# EAGLE design untitled (EAGLE 9.6.2)
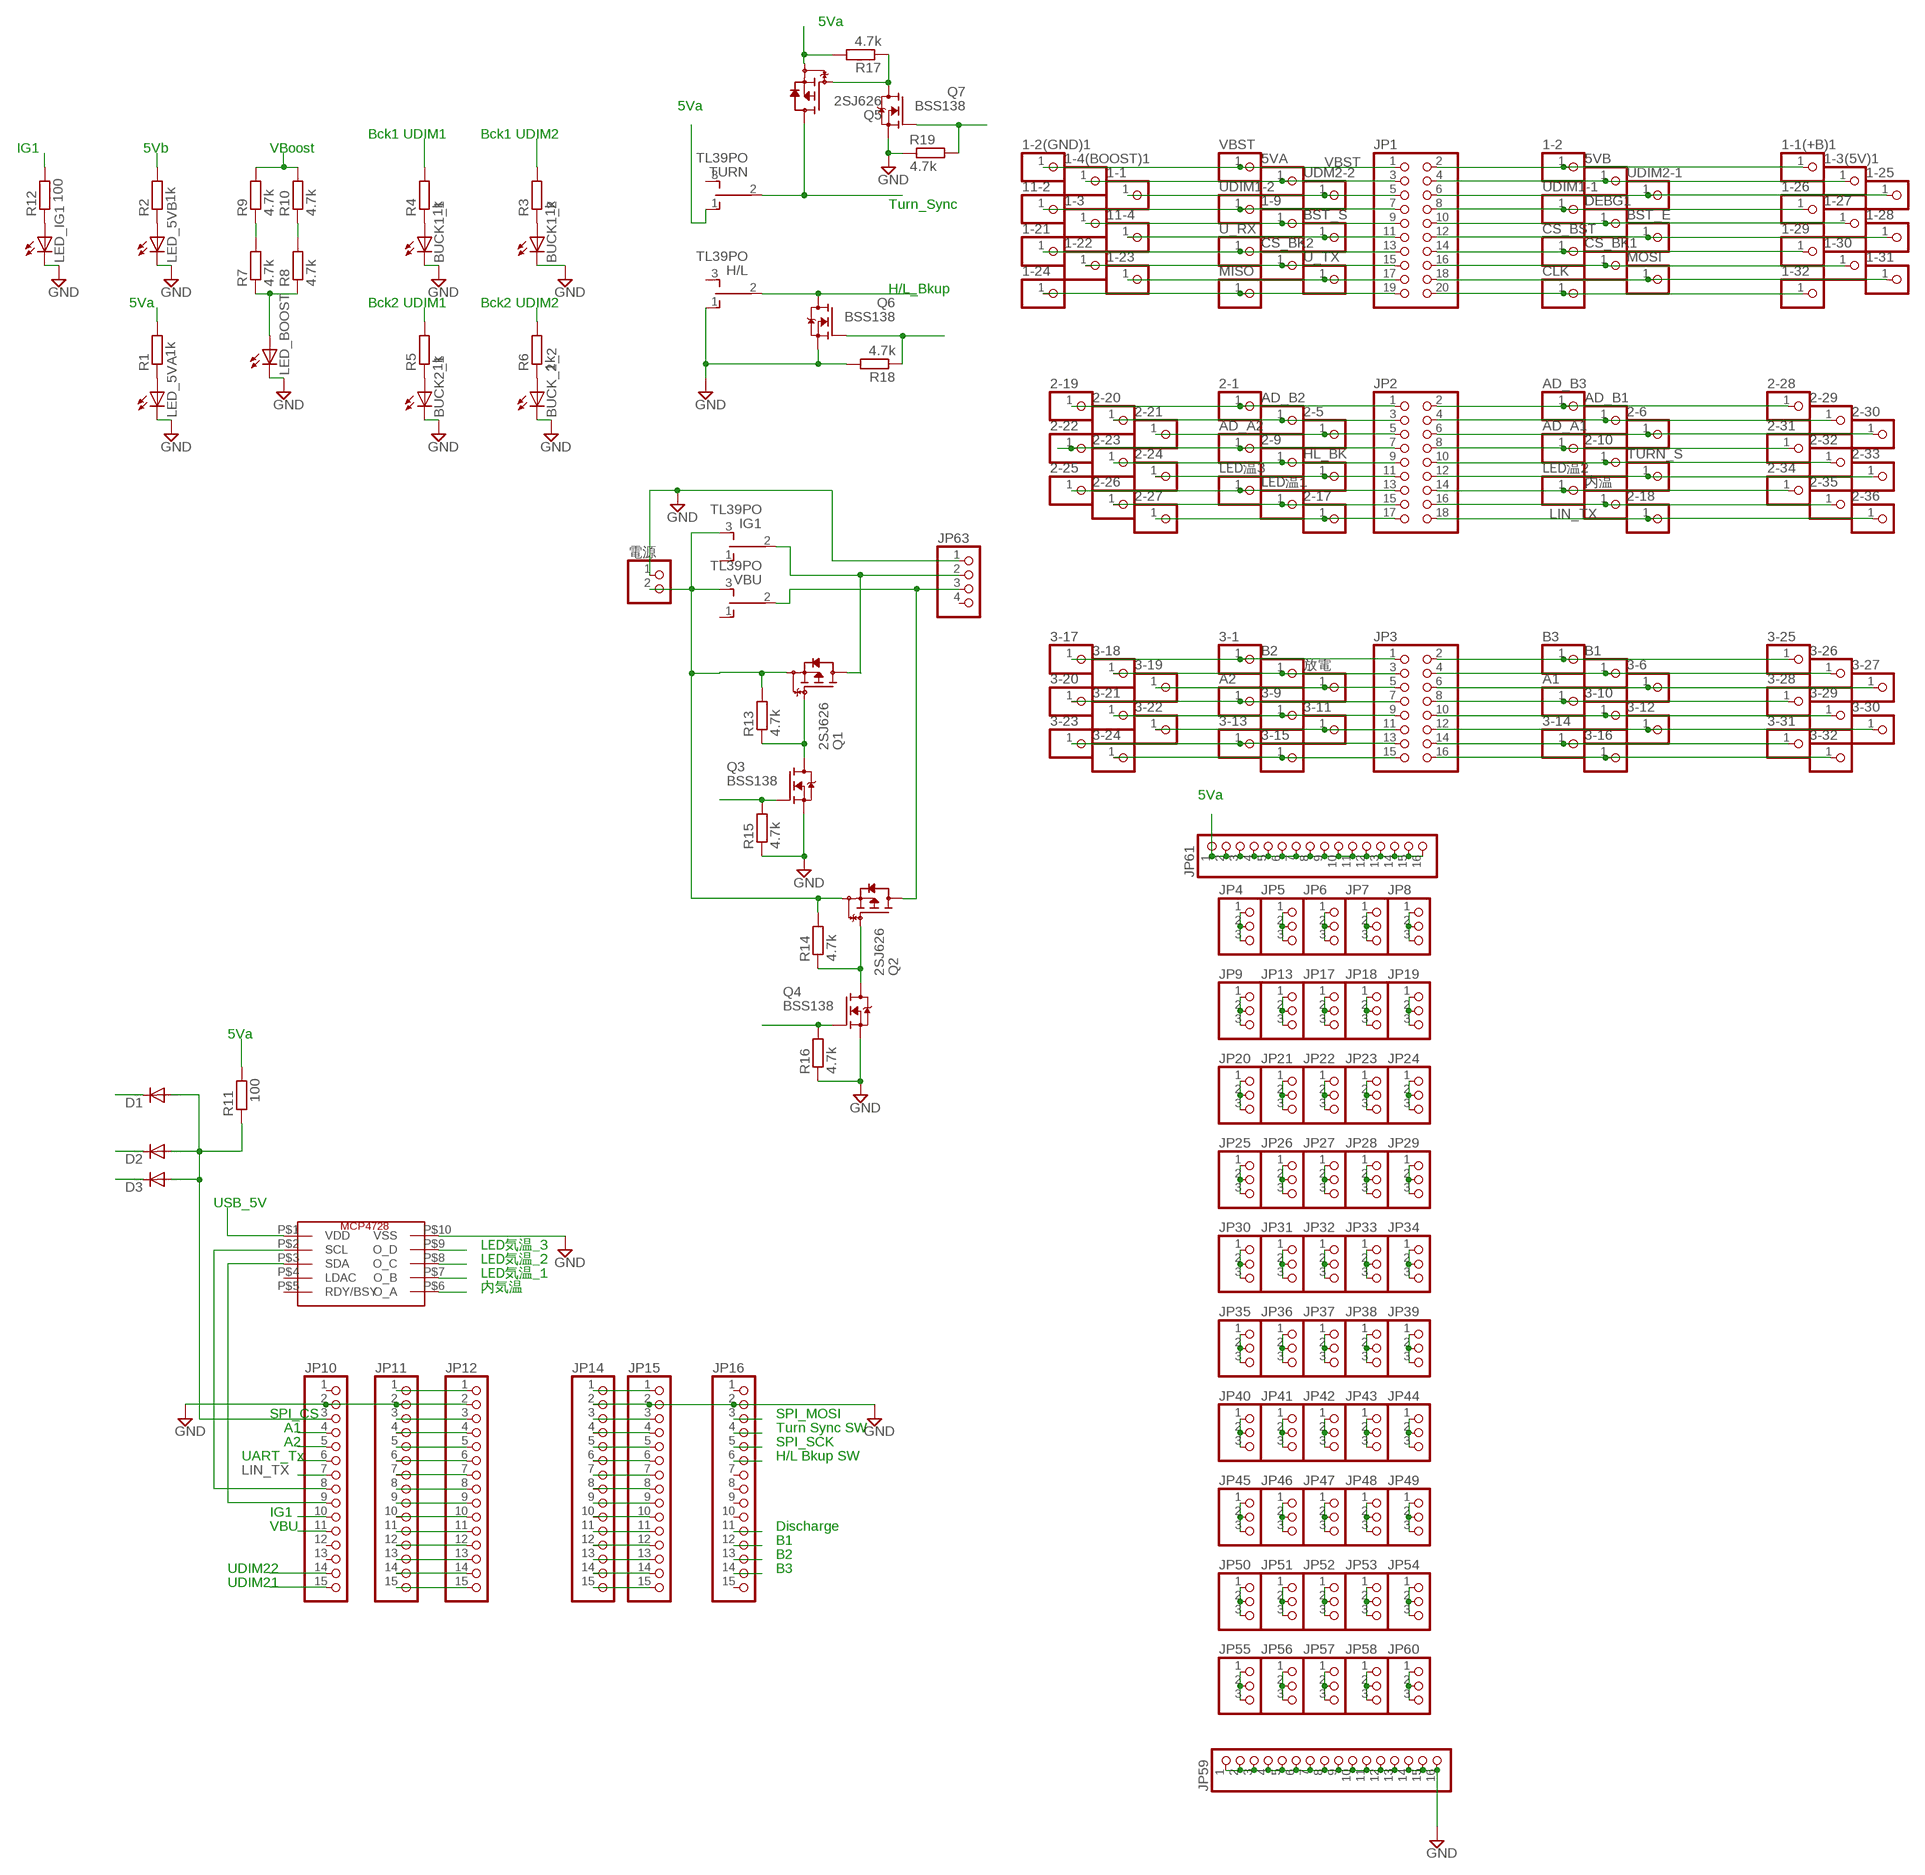
[diagram p0: schematic, sheet 1]

## Parts
1-1  PINHD-1X1  [1X01]
1-1(+B)1  PINHD-1X1  [1X01]
1-2  PINHD-1X1  [1X01]
1-2(GND)1  PINHD-1X1  [1X01]
1-3  PINHD-1X1  [1X01]
1-3(5V)1  PINHD-1X1  [1X01]
1-4(BOOST)1  PINHD-1X1  [1X01]
1-9  PINHD-1X1  [1X01]
1-21  PINHD-1X1  [1X01]
1-22  PINHD-1X1  [1X01]
1-23  PINHD-1X1  [1X01]
1-24  PINHD-1X1  [1X01]
1-25  PINHD-1X1  [1X01]
1-26  PINHD-1X1  [1X01]
1-27  PINHD-1X1  [1X01]
1-28  PINHD-1X1  [1X01]
1-29  PINHD-1X1  [1X01]
1-30  PINHD-1X1  [1X01]
1-31  PINHD-1X1  [1X01]
1-32  PINHD-1X1  [1X01]
2-1  PINHD-1X1  [1X01]
2-5  PINHD-1X1  [1X01]
2-6  PINHD-1X1  [1X01]
2-9  PINHD-1X1  [1X01]
2-10  PINHD-1X1  [1X01]
2-17  PINHD-1X1  [1X01]
2-18  PINHD-1X1  [1X01]
2-19  PINHD-1X1  [1X01]
2-20  PINHD-1X1  [1X01]
2-21  PINHD-1X1  [1X01]
2-22  PINHD-1X1  [1X01]
2-23  PINHD-1X1  [1X01]
2-24  PINHD-1X1  [1X01]
2-25  PINHD-1X1  [1X01]
2-26  PINHD-1X1  [1X01]
2-27  PINHD-1X1  [1X01]
2-28  PINHD-1X1  [1X01]
2-29  PINHD-1X1  [1X01]
2-30  PINHD-1X1  [1X01]
2-31  PINHD-1X1  [1X01]
2-32  PINHD-1X1  [1X01]
2-33  PINHD-1X1  [1X01]
2-34  PINHD-1X1  [1X01]
2-35  PINHD-1X1  [1X01]
2-36  PINHD-1X1  [1X01]
3-1  PINHD-1X1  [1X01]
3-6  PINHD-1X1  [1X01]
3-9  PINHD-1X1  [1X01]
3-10  PINHD-1X1  [1X01]
3-11  PINHD-1X1  [1X01]
3-12  PINHD-1X1  [1X01]
3-13  PINHD-1X1  [1X01]
3-14  PINHD-1X1  [1X01]
3-15  PINHD-1X1  [1X01]
3-16  PINHD-1X1  [1X01]
3-17  PINHD-1X1  [1X01]
3-18  PINHD-1X1  [1X01]
3-19  PINHD-1X1  [1X01]
3-20  PINHD-1X1  [1X01]
3-21  PINHD-1X1  [1X01]
3-22  PINHD-1X1  [1X01]
3-23  PINHD-1X1  [1X01]
3-24  PINHD-1X1  [1X01]
3-25  PINHD-1X1  [1X01]
3-26  PINHD-1X1  [1X01]
3-27  PINHD-1X1  [1X01]
3-28  PINHD-1X1  [1X01]
3-29  PINHD-1X1  [1X01]
3-30  PINHD-1X1  [1X01]
3-31  PINHD-1X1  [1X01]
3-32  PINHD-1X1  [1X01]
5VA  PINHD-1X1  [1X01]
5VB  PINHD-1X1  [1X01]
11-2  PINHD-1X1  [1X01]
11-4  PINHD-1X1  [1X01]
A1  PINHD-1X1  [1X01]
A2  PINHD-1X1  [1X01]
AD_A1  PINHD-1X1  [1X01]
AD_A2  PINHD-1X1  [1X01]
AD_B1  PINHD-1X1  [1X01]
AD_B2  PINHD-1X1  [1X01]
AD_B3  PINHD-1X1  [1X01]
B1  PINHD-1X1  [1X01]
B2  PINHD-1X1  [1X01]
B3  PINHD-1X1  [1X01]
BST_E  PINHD-1X1  [1X01]
BST_S  PINHD-1X1  [1X01]
BUCK1_1  LEDCHIP-LED0603  [CHIP-LED0603]
BUCK1_2  LEDCHIP-LED0603  [CHIP-LED0603]
BUCK2_1  LEDCHIP-LED0603  [CHIP-LED0603]
BUCK_2_2  LEDCHIP-LED0603  [CHIP-LED0603]
CLK  PINHD-1X1  [1X01]
CS_BK1  PINHD-1X1  [1X01]
CS_BK2  PINHD-1X1  [1X01]
CS_BST  PINHD-1X1  [1X01]
D1  DIODE-SOD523  [SOD523]
D2  DIODE-SOD523  [SOD523]
D3  DIODE-SOD523  [SOD523]
DEBG1  PINHD-1X1  [1X01]
H/L  TL39PO  [TL3XPO]
HL_BK  PINHD-1X1  [1X01]
IG1  TL39PO  [TL3XPO]
JP1  PINHD-2X10  [2X10]
JP2  PINHD-2X9  [2X09]
JP3  PINHD-2X8  [2X08]
JP4  PINHD-1X3  [1X03]
JP5  PINHD-1X3  [1X03]
JP6  PINHD-1X3  [1X03]
JP7  PINHD-1X3  [1X03]
JP8  PINHD-1X3  [1X03]
JP9  PINHD-1X3  [1X03]
JP10  PINHD-1X15  [1X15]
JP11  PINHD-1X15  [1X15]
JP12  PINHD-1X15  [1X15]
JP13  PINHD-1X3  [1X03]
JP14  PINHD-1X15  [1X15]
JP15  PINHD-1X15  [1X15]
JP16  PINHD-1X15  [1X15]
JP17  PINHD-1X3  [1X03]
JP18  PINHD-1X3  [1X03]
JP19  PINHD-1X3  [1X03]
JP20  PINHD-1X3  [1X03]
JP21  PINHD-1X3  [1X03]
JP22  PINHD-1X3  [1X03]
JP23  PINHD-1X3  [1X03]
JP24  PINHD-1X3  [1X03]
JP25  PINHD-1X3  [1X03]
JP26  PINHD-1X3  [1X03]
JP27  PINHD-1X3  [1X03]
JP28  PINHD-1X3  [1X03]
JP29  PINHD-1X3  [1X03]
JP30  PINHD-1X3  [1X03]
JP31  PINHD-1X3  [1X03]
JP32  PINHD-1X3  [1X03]
JP33  PINHD-1X3  [1X03]
JP34  PINHD-1X3  [1X03]
JP35  PINHD-1X3  [1X03]
JP36  PINHD-1X3  [1X03]
JP37  PINHD-1X3  [1X03]
JP38  PINHD-1X3  [1X03]
JP39  PINHD-1X3  [1X03]
JP40  PINHD-1X3  [1X03]
JP41  PINHD-1X3  [1X03]
JP42  PINHD-1X3  [1X03]
JP43  PINHD-1X3  [1X03]
JP44  PINHD-1X3  [1X03]
JP45  PINHD-1X3  [1X03]
JP46  PINHD-1X3  [1X03]
JP47  PINHD-1X3  [1X03]
JP48  PINHD-1X3  [1X03]
JP49  PINHD-1X3  [1X03]
JP50  PINHD-1X3  [1X03]
JP51  PINHD-1X3  [1X03]
JP52  PINHD-1X3  [1X03]
JP53  PINHD-1X3  [1X03]
JP54  PINHD-1X3  [1X03]
JP55  PINHD-1X3  [1X03]
JP56  PINHD-1X3  [1X03]
JP57  PINHD-1X3  [1X03]
JP58  PINHD-1X3  [1X03]
JP59  PINHD-1X16  [1X16]
JP60  PINHD-1X3  [1X03]
JP61  PINHD-1X16  [1X16]
JP63  PINHD-1X4  [1X04]
LED_5VA  LEDCHIP-LED0603  [CHIP-LED0603]
LED_5VB  LEDCHIP-LED0603  [CHIP-LED0603]
LED_BOOST  LEDCHIP-LED0603  [CHIP-LED0603]
LED_IG1  LEDCHIP-LED0603  [CHIP-LED0603]
LED温1  PINHD-1X1  [1X01]
LED温2  PINHD-1X1  [1X01]
LED温3  PINHD-1X1  [1X01]
MISO  PINHD-1X1  [1X01]
MOSI  PINHD-1X1  [1X01]
Q1  2SJ626  [SOT23]
Q2  2SJ626  [SOT23]
Q3  BSS138  [SOT23]
Q4  BSS138  [SOT23]
Q5  2SJ626  [SOT23]
Q6  BSS138  [SOT23]
Q7  BSS138  [SOT23]
R1  1k  R-EU_R0603  [R0603]
R2  1k  R-EU_R0603  [R0603]
R3  1k  R-EU_R0603  [R0603]
R4  1k  R-EU_R0603  [R0603]
R5  1k  R-EU_R0603  [R0603]
R6  1k  R-EU_R0603  [R0603]
R7  4.7k  R-EU_R0603  [R0603]
R8  4.7k  R-EU_R0603  [R0603]
R9  4.7k  R-EU_R0603  [R0603]
R10  4.7k  R-EU_R0603  [R0603]
R11  100  R-EU_R0603  [R0603]
R12  100  R-EU_R0603  [R0603]
R13  4.7k  R-EU_R0603  [R0603]
R14  4.7k  R-EU_R0603  [R0603]
R15  4.7k  R-EU_R0603  [R0603]
R16  4.7k  R-EU_R0603  [R0603]
R17  4.7k  R-EU_R0603  [R0603]
R18  4.7k  R-EU_R0603  [R0603]
R19  4.7k  R-EU_R0603  [R0603]
TURN  TL39PO  [TL3XPO]
TURN_S  PINHD-1X1  [1X01]
U$1  MCP4728  [MCP4728]
U_RX  PINHD-1X1  [1X01]
U_TX  PINHD-1X1  [1X01]
UDIM1-1  PINHD-1X1  [1X01]
UDIM1-2  PINHD-1X1  [1X01]
UDIM2-1  PINHD-1X1  [1X01]
UDM2-2  PINHD-1X1  [1X01]
VBST  PINHD-1X1  [1X01]
VBU  TL39PO  [TL3XPO]
内温  PINHD-1X1  [1X01]
放電  PINHD-1X1  [1X01]
電源  PINHD-1X2  [1X02]

## Nets
5VA: 1-4(BOOST)1.1 5VA.1 JP1.3 JP61.1 JP61.2 JP61.3 JP61.4 JP61.5 JP61.6 JP61.7 JP61.8 JP61.9 JP61.10 JP61.11 JP61.12 JP61.13 JP61.14 JP61.15 JP61.16 Q5.2(S) R1.2 R11.2 R17.2 TURN.1(O)
5VB: 1-3(5V)1.1 5VB.1 JP1.4 R2.2
+B: 1-1(+B)1.1 1-2.1 JP1.2
+B(電源): IG1.3(S) Q1.2(S) Q2.2(S) R13.2 R14.2 VBU.3(S) 電源.2
A1: 3-28.1 A1.1 JP3.8 JP10.4
A2: 3-20.1 A2.1 JP3.7 JP10.5
AD_A1: 2-31.1 AD_A1.1 JP2.8
AD_A2: 2-22.1 AD_A2.1 JP2.7
AD_B1: 2-29.1 AD_B1.1 JP2.4
AD_B2: 2-20.1 AD_B2.1 JP2.3
AD_B3: 2-28.1 AD_B3.1 JP2.2
B1: 3-26.1 B1.1 JP3.4 JP16.12
B2: 3-18.1 B2.1 JP3.3 JP16.13
B3: 3-25.1 B3.1 JP3.2 JP16.14
BCK1UDIM1: 1-26.1 JP1.8 R4.2 UDIM1-1.1
BCK1UDIM2: 11-2.1 JP1.7 R3.2 UDIM1-2.1
BCK2UDIM1: 1-25.1 JP1.6 JP10.15 R5.2 UDIM2-1.1
BCK2UDIM2: 1-1.1 JP1.5 JP10.14 R6.2 UDM2-2.1
BSTENABLE: 1-28.1 BST_E.1 JP1.12
BSTSYNC: 11-4.1 BST_S.1 JP1.11
DEBUG1: 1-27.1 DEBG1.1 JP1.10
DISCHARGE: 3-19.1 JP3.5 JP16.11 放電.1
ESP32_HL_BKUP: JP16.6 Q6.1(G) R18.1
ESP32_SPI_CS: D1.A D2.A D3.A JP10.3 R11.1
ESP32_TURN_SYNC: JP16.4 Q7.1(G) R19.2
ESP_IG1_SW: JP10.10 Q3.1(G) R15.2
ESP_VBU_SW: JP10.11 Q4.1(G) R16.2
GND: BUCK1_1.C BUCK1_2.C BUCK2_1.C BUCK_2_2.C H/L.1(O) JP10.2 JP11.2 JP12.2 JP14.2 JP15.2 JP16.2 JP59.1 JP59.2 JP59.3 JP59.4 JP59.5 JP59.6 JP59.7 JP59.8 JP59.9 JP59.10 JP59.11 JP59.12 JP59.13 JP59.14 JP59.15 JP59.16 JP63.1 LED_5VA.C LED_5VB.C LED_BOOST.C LED_IG1.C Q3.2(S) Q4.2(S) Q6.2(S) Q7.2(S) R15.1 R16.1 R18.2 R19.1 U$1.P$10(VSS) 電源.1
HL_BKUP: 2-24.1 H/L.2(P) HL_BK.1 JP2.11 Q6.3(D)
IG1: IG1.2(P) JP63.2 Q1.3(D) R12.2
INSIDE_THM: 2-35.1 JP2.16 U$1.P$6(O_A) 内温.1
LED_THM1: 2-26.1 JP2.15 LED温1.1 U$1.P$7(O_B)
LED_THM2: 2-34.1 JP2.14 LED温2.1 U$1.P$8(O_C)
LED_THM3: 2-25.1 JP2.13 LED温3.1 U$1.P$9(O_D)
LIN_TX: 2-18.1 2-36.1 JP2.18 JP10.7
N$1: LED_5VB.A R2.1
N$2: LED_5VA.A R1.1
N$3: BUCK1_1.A R4.1
N$4: R7.2 R9.1
N$6: R8.2 R10.1
N$7: JP4.1 JP4.2 JP4.3
N$8: JP5.1 JP5.2 JP5.3
N$9: JP6.1 JP6.2 JP6.3
N$10: JP7.1 JP7.2 JP7.3
N$11: JP8.1 JP8.2 JP8.3
N$12: JP9.1 JP9.2 JP9.3
N$13: JP13.1 JP13.2 JP13.3
N$14: JP17.1 JP17.2 JP17.3
N$15: JP18.1 JP18.2 JP18.3
N$16: JP19.1 JP19.2 JP19.3
N$17: 1-3.1 1-9.1 JP1.9
N$18: JP20.1 JP20.2 JP20.3
N$19: JP21.1 JP21.2 JP21.3
N$20: BUCK1_2.A R3.1
N$21: 2-1.1 2-19.1 JP2.1
N$22: JP22.1 JP22.2 JP22.3
N$23: 2-5.1 2-21.1 JP2.5
N$24: JP23.1 JP23.2 JP23.3
N$25: 2-9.1 2-23.1 JP2.9
N$26: JP24.1 JP24.2 JP24.3
N$27: JP25.1 JP25.2 JP25.3
N$28: JP26.1 JP26.2 JP26.3
N$29: 2-17.1 2-27.1 JP2.17
N$31: JP27.1 JP27.2 JP27.3
N$32: JP28.1 JP28.2 JP28.3
N$33: JP29.1 JP29.2 JP29.3
N$34: 2-10.1 2-32.1 JP2.10
N$35: JP30.1 JP30.2 JP30.3
N$36: 2-6.1 2-30.1 JP2.6
N$37: JP31.1 JP31.2 JP31.3
N$38: JP32.1 JP32.2 JP32.3
N$39: 3-1.1 3-17.1 JP3.1
N$40: JP33.1 JP33.2 JP33.3
N$41: JP34.1 JP34.2 JP34.3
N$42: JP35.1 JP35.2 JP35.3
N$43: 3-9.1 3-21.1 JP3.9
N$44: 3-11.1 3-22.1 JP3.11
N$45: 3-13.1 3-23.1 JP3.13
N$46: 3-15.1 3-24.1 JP3.15
N$47: JP36.1 JP36.2 JP36.3
N$48: JP14.3 JP15.3
N$49: 3-6.1 3-27.1 JP3.6
N$50: JP37.1 JP37.2 JP37.3
N$51: 3-10.1 3-29.1 JP3.10
N$52: 3-12.1 3-30.1 JP3.12
N$53: 3-14.1 3-31.1 JP3.14
N$54: 3-16.1 3-32.1 JP3.16
N$55: BUCK2_1.A R5.1
N$56: BUCK_2_2.A R6.1
N$57: JP38.1 JP38.2 JP38.3
N$58: LED_BOOST.A R7.1 R8.1
N$59: Q5.1(G) Q7.3(D) R17.1
N$60: LED_IG1.A R12.1
N$61: JP14.4 JP15.4
N$62: Q1.1(G) Q3.3(D) R13.1
N$63: Q2.1(G) Q4.3(D) R14.1
N$64: JP14.5 JP15.5
N$65: JP14.6 JP15.6
N$66: JP14.7 JP15.7
N$67: JP14.8 JP15.8
N$68: JP14.9 JP15.9
N$70: JP14.10 JP15.10
N$71: JP14.11 JP15.11
N$72: JP14.12 JP15.12
N$73: JP14.13 JP15.13
N$74: JP14.14 JP15.14
N$75: JP14.15 JP15.15
N$76: JP11.1 JP12.1
N$77: JP39.1 JP39.2 JP39.3
N$78: JP11.3 JP12.3
N$79: JP11.4 JP12.4
N$80: JP11.5 JP12.5
N$81: JP11.6 JP12.6
N$82: JP11.8 JP12.8
N$83: JP11.7 JP12.7
N$84: JP11.9 JP12.9
N$85: JP11.10 JP12.10
N$86: JP11.11 JP12.11
N$87: JP11.12 JP12.12
N$88: JP11.13 JP12.13
N$89: JP11.14 JP12.14
N$90: JP11.15 JP12.15
N$91: JP10.8 U$1.P$2(SCL)
N$92: JP10.9 U$1.P$3(SDA)
N$93: JP40.1 JP40.2 JP40.3
N$94: JP41.1 JP41.2 JP41.3
N$95: JP42.1 JP42.2 JP42.3
N$96: JP43.1 JP43.2 JP43.3
N$97: JP44.1 JP44.2 JP44.3
N$98: JP45.1 JP45.2 JP45.3
N$99: JP46.1 JP46.2 JP46.3
N$100: JP47.1 JP47.2 JP47.3
N$101: JP48.1 JP48.2 JP48.3
N$102: JP49.1 JP49.2 JP49.3
N$103: JP50.1 JP50.2 JP50.3
N$104: JP51.1 JP51.2 JP51.3
N$105: JP52.1 JP52.2 JP52.3
N$106: JP53.1 JP53.2 JP53.3
N$107: JP54.1 JP54.2 JP54.3
N$108: JP55.1 JP55.2 JP55.3
N$109: JP56.1 JP56.2 JP56.3
N$110: JP57.1 JP57.2 JP57.3
N$111: JP58.1 JP58.2 JP58.3
N$112: JP60.1 JP60.2 JP60.3
SPI_CLK: 1-32.1 CLK.1 JP1.20 JP16.5
SPI_CS_BK1: 1-30.1 CS_BK1.1 D1.C JP1.16
SPI_CS_BK2: 1-22.1 CS_BK2.1 D2.C JP1.15
SPI_CS_BST: 1-29.1 CS_BST.1 D3.C JP1.14
SPI_MISO: 1-24.1 JP1.19 MISO.1
SPI_MOSI: 1-31.1 JP1.18 JP16.3 MOSI.1
TURN_SYNC: 2-33.1 JP2.12 Q5.3(D) TURN.2(P) TURN_S.1
UARTRX: 1-21.1 JP1.13 U_RX.1
UARTTX: 1-23.1 JP1.17 JP10.6 U_TX.1
USB_5V: JP14.1 JP15.1 U$1.P$1(VDD)
VBST: 1-2(GND)1.1 JP1.1 R9.2 R10.2 VBST.1
VBU: JP63.3 Q2.3(D) VBU.2(P)
Unconnected: H/L.3(S) IG1.1(O) JP10.1 JP10.12 JP10.13 JP16.1 JP16.7 JP16.8 JP16.9 JP16.10 JP16.15 JP63.4 TURN.3(S) U$1.P$4(LDAC) U$1.P$5(RDY/BSY) VBU.1(O)

## Notes on the sheet
- 5Va
- 5Va
- Bck1 UDIM1 | Bck1 UDIM2
- IG1 | 5Vb | VBoost
- Turn_Sync
- H/L_Bkup
- 5Va | Bck2 UDIM1 | Bck2 UDIM2
- 5Va
- 5Va
- USB_5V
- LED気温_3
- LED気温_2
- LED気温_1
- 内気温
- SPI_CS | SPI_MOSI
- A1 | Turn Sync SW
- A2 | SPI_SCK
- UART_Tx | H/L Bkup SW
- IG1
- VBU | Discharge
- B1
- B2
- UDIM22 | B3
- UDIM21

## Library data of the parts
1-1 1-1(+B)1 1-2 1-2(GND)1 1-3 1-3(5V)1 1-4(BOOST)1 1-9 1-21-1-32 2-1 2-5 2-6 2-9 2-10 2-17-2-36 3-1 3-6 3-9-3-32 5VA 5VB 11-2 11-4 A1 A2 AD_A1 AD_A2 AD_B1-AD_B3 B1-B3 BST_E BST_S CLK CS_BK1 CS_BK2 CS_BST DEBG1 HL_BK LED温1-LED温3 MISO MOSI TURN_S U_RX U_TX UDIM1-1 UDIM1-2 UDIM2-1 UDM2-2 VBST 内温 放電 = pinhead:PINHD-1X1: PIN HEADER
BUCK1_1 BUCK1_2 BUCK2_1 BUCK_2_2 LED_5VA LED_5VB LED_BOOST LED_IG1 = led:LED: LED OSRAM: - CHIPLED LG R971, LG N971, LY N971, LG Q971, LY Q971, LO R971, LY R971 LH N974, LH R974 LS Q976, LO Q976, LY Q976 LO Q996 - Hyper CHIPLED LW Q18S LB Q993, LB Q99A, LB R99A - SideLED LS A670, LO A670, LY A670, LG A670, LP A670 LB A673, LV A673, LT A673, LW A673 LH A674 LY A675 LS A676, LA A676, LO A676, LY A676, LW A676 LS A679, LY A679, LG A679 - Hyper Micro SIDELED® LS Y876, LA Y876, LO Y876, LY Y876 LT Y87S - SmartLED LW L88C, LW L88S LB L89C, LB L89S, LG L890 LS L89K, LO L89K, LY L89K LS L896, LA L896, LO L896, LY L896 - TOPLED LS T670, LO T670, LY T670, LG T670, LP T670 LSG T670, LSP T670, LSY T670, LOP T670, LYG T670 LG T671, LOG T671, LSG T671 LB T673, LV T673, LT T673, LW T673 LH T674 LS T676, LA T676, LO T676, LY T676, LB T676, LH T676, LSB T676, LW T676 LB T67C, LV T67C, LT T67C, LS T67K, LO T67K, LY T67K, LW E67C LS E67B, LA E67B, LO E67B, LY E67B, LB E67C, LV E67C, LT E67C LW T67C LS T679, LY T679, LG T679 LS T770, LO T770, LY T770, LG T770, LP T770 LB T773, LV T773, LT T773, LW T773 LH T774 LS E675, LA E675, LY E675, LS T675 LS T776, LA T776, LO T776, LY T776, LB T776 LHGB T686 LT T68C, LB T68C - Hyper Mini TOPLED® LB M676 - Mini TOPLED Santana® LG M470 LS M47K, LO M47K, LY M47K Source: http://www.osram.convergy.de LUXEON: - LUMILED® LXK2-PW12-R00, LXK2-PW12-S00, LXK2-PW14-U00, LXK2-PW14-V00 LXK2-PM12-R00, LXK2-PM12-S00, LXK2-PM14-U00 LXK2-PE12-Q00, LXK2-PE12-R00, LXK2-PE12-S00, LXK2-PE14-T00, LXK2-PE14-U00 LXK2-PB12-K00, LXK2-PB12-L00, LXK2-PB12-M00, LXK2-PB14-N00, LXK2-PB14-P00, LXK2-PB14-Q00 LXK2-PR12-L00, LXK2-PR12-M00, LXK2-PR14-Q00, LXK2-PR14-R00 LXK2-PD12-Q00, LXK2-PD12-R00, LXK2-PD12-S00 LXK2-PH12-R00, LXK2-PH12-S00 LXK2-PL12-P00, LXK2-PL12-Q00, LXK2-PL12-R00 Source: www.luxeon.com KINGBRIGHT: KA-3528ASYC Source: www.kingbright.com
D1-D3 = diode:DIODE-: DIODE
H/L IG1 TURN VBU = switch:TL39PO: TINY SWITCH ON OFF ON Source: http://www2.produktinfo.conrad.com/datenblaetter/700000-724999/705152-da-01-de-Subminiaturschalter_TL_36YO.pdf
JP1 = pinhead:PINHD-2X10: PIN HEADER
JP2 = pinhead:PINHD-2X9: PIN HEADER
JP3 = pinhead:PINHD-2X8: PIN HEADER
JP4-JP9 JP13 JP17-JP58 JP60 = pinhead:PINHD-1X3: PIN HEADER
JP10-JP12 JP14-JP16 = pinhead:PINHD-1X15: PIN HEADER
JP59 JP61 = pinhead:PINHD-1X16: PIN HEADER
JP63 = pinhead:PINHD-1X4: PIN HEADER
Q1 Q2 Q5 = 2sj626:2SJ626: 2SJ626 N-Channel Logic Level Enhancement Mode Field Effect Transistor Source: http://www.fairchildsemi.com/datasheets/BS/BSS138.pdf; MF: Fairchild; MPN: 2SJ626; OC_FARNELL: 9845330; OC_NEWARK: 67R2009
Q3 Q4 Q6 Q7 = bss138_10:BSS138: BSS138 N-Channel Logic Level Enhancement Mode Field Effect Transistor Source: http://www.fairchildsemi.com/datasheets/BS/BSS138.pdf; MF: Fairchild; MPN: BSS138; OC_FARNELL: 9845330; OC_NEWARK: 67R2009
R1-R19 = rcl:R-EU_: RESISTOR, European symbol
U$1 = MCP4728:MCP4728
電源 = pinhead:PINHD-1X2: PIN HEADER

## Board
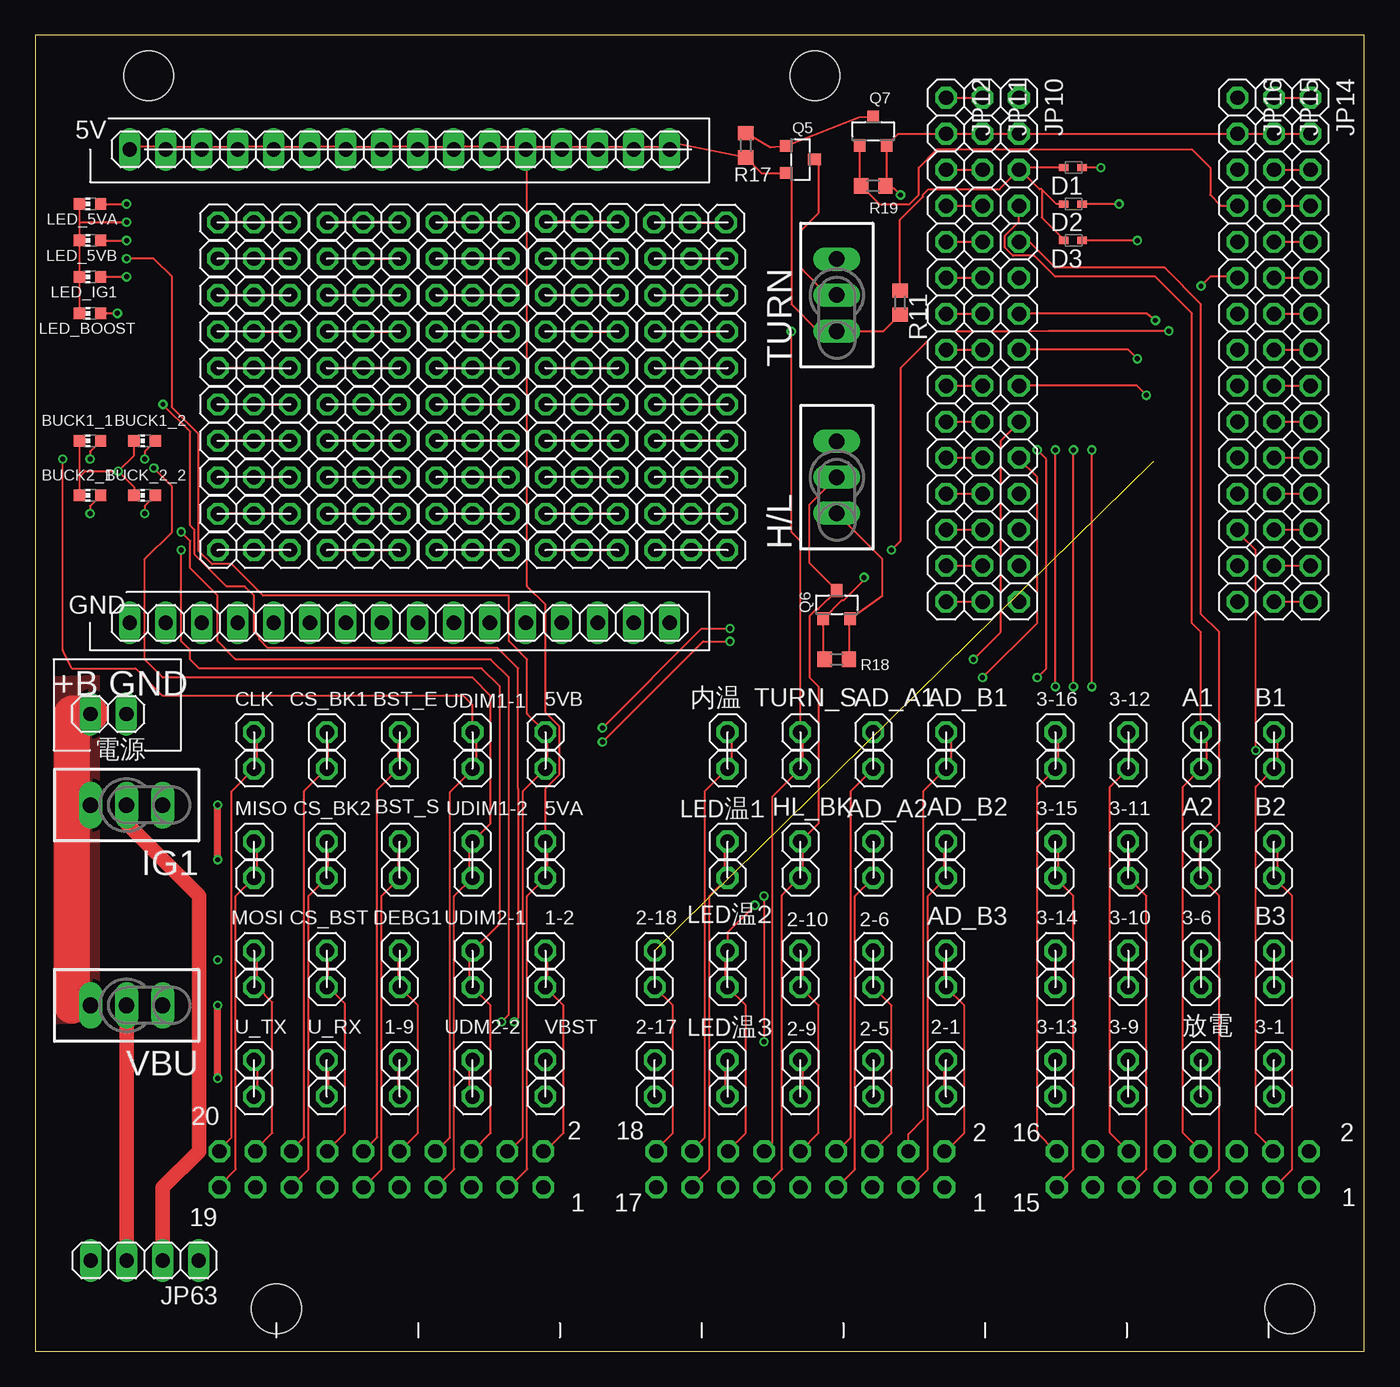
[diagram p1: board, top side]
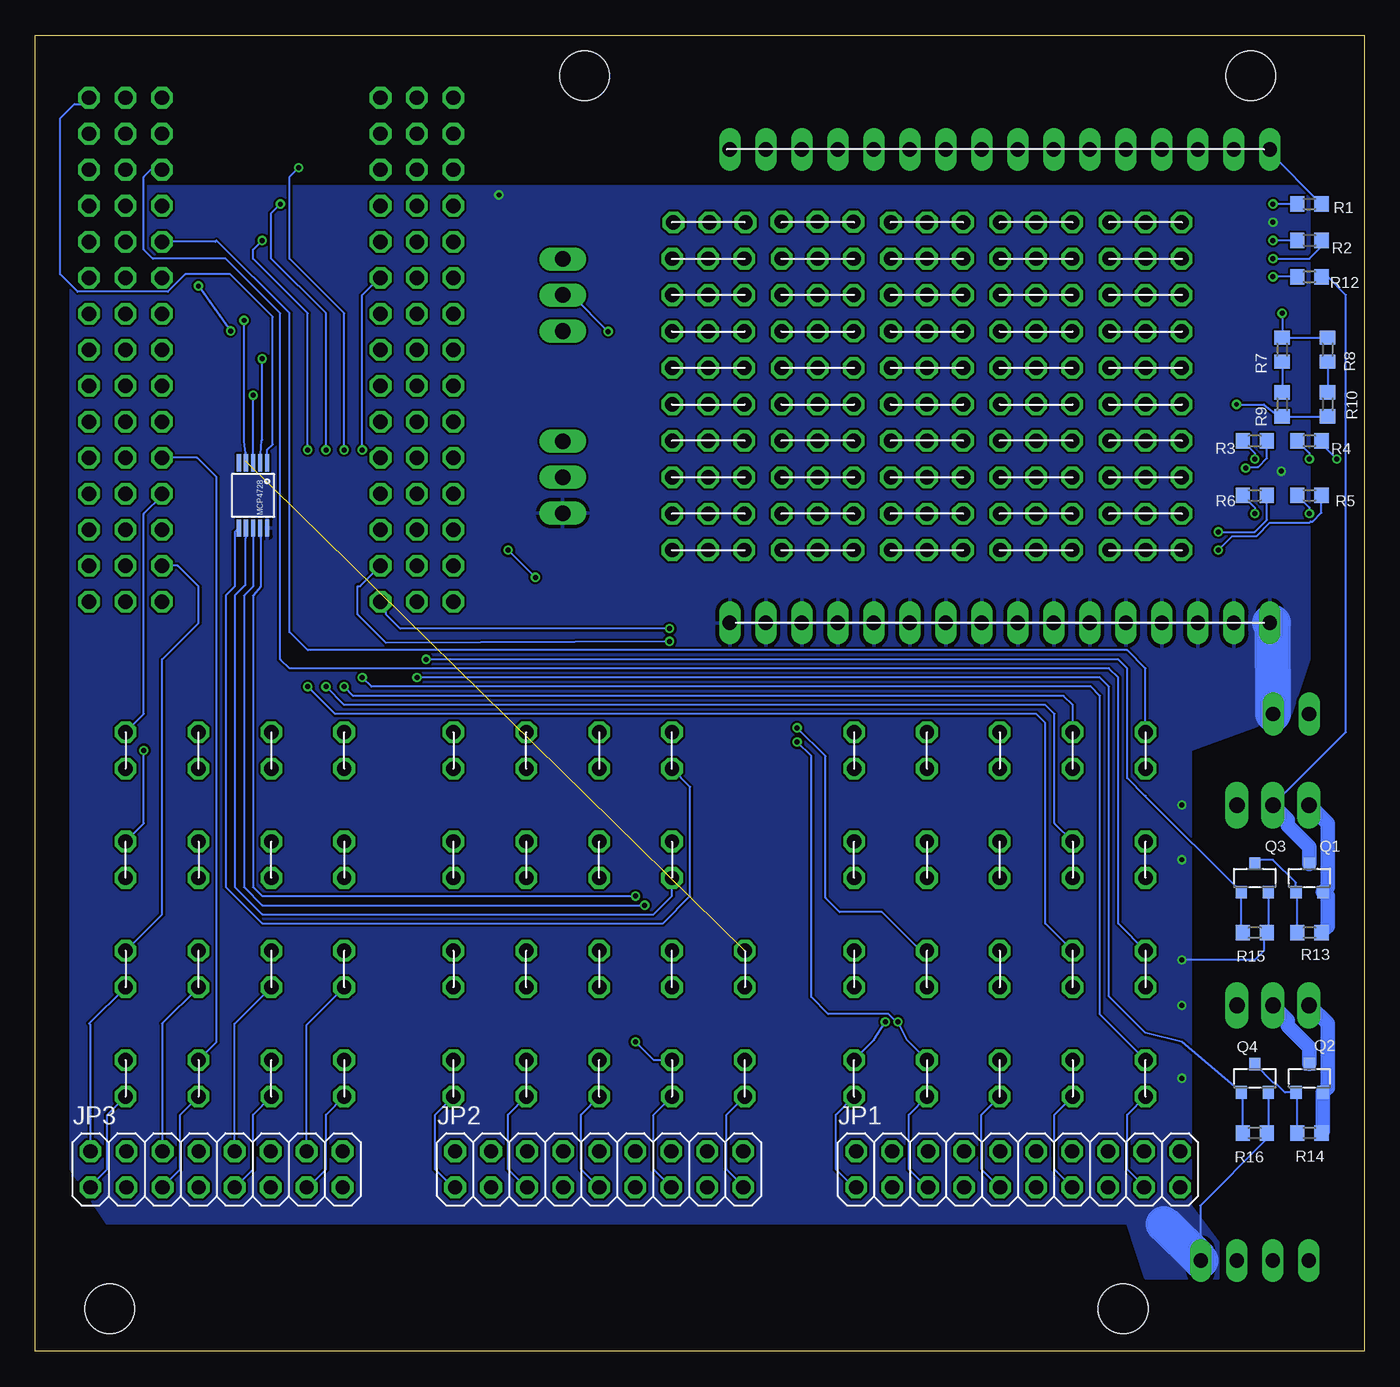
[diagram p2: board, bottom side, seen from below]

Size 93.74 x 92.85 mm. Coordinates in mm from the lower left corner, seen from the top.
Outline: 0,0 93.74,0 93.74,92.85 0,92.85 0,0
Copper layers (1*16): Top 0.035mm / dielectric 1.6mm / Bottom 0.035mm
Design rules "Elecrow_2-layer_PCB_eagle_rule": minimum track width 6mil, minimum drill 12mil, track to track 6mil, track to pad 6mil, pad to pad 6mil, via to via 8mil, smd to smd 0mil, copper to edge 20mil, drill to drill 10mil, minimum pad ring 6mil, minimum via ring 6mil, stop-mask expansion 0mil, vias tented up to drill 100mil, thermal gap 10mil
Holes 3.5 mm at 17,3 88.5,3 8,90 55,90

### Footprints (pad centres in the part's own frame; a part is rotated, then mirrored left to right if it is on the bottom)
1X01 = drill 1.016 octagon: 1 0,0
CHIP-LED0603 = smd 0.8 x 0.8: A 0,-0.75; C 0,0.75
SOD523 = smd 0.7 x 0.5: A 0.7,0; C -0.6,0
TL3XPO = drill 1.1 pad 1.422 long: 1 -2.54,0; 2 0,0; 3 2.54,0
2X10 = drill 1.016 octagon: 1 -11.43,-1.27; 2 -11.43,1.27; 3 -8.89,-1.27; 4 -8.89,1.27; 5 -6.35,-1.27; 6 -6.35,1.27; 7 -3.81,-1.27; 8 -3.81,1.27; 9 -1.27,-1.27; 10 -1.27,1.27; 11 1.27,-1.27; 12 1.27,1.27; 13 3.81,-1.27; 14 3.81,1.27; 15 6.35,-1.27; 16 6.35,1.27; 17 8.89,-1.27; 18 8.89,1.27; 19 11.43,-1.27; 20 11.43,1.27
2X09 = drill 1.016 octagon: 1 -10.16,-1.27; 2 -10.16,1.27; 3 -7.62,-1.27; 4 -7.62,1.27; 5 -5.08,-1.27; 6 -5.08,1.27; 7 -2.54,-1.27; 8 -2.54,1.27; 9 0,-1.27; 10 0,1.27; 11 2.54,-1.27; 12 2.54,1.27; 13 5.08,-1.27; 14 5.08,1.27; 15 7.62,-1.27; 16 7.62,1.27; 17 10.16,-1.27; 18 10.16,1.27
2X08 = drill 1.016 octagon: 1 -8.89,-1.27; 2 -8.89,1.27; 3 -6.35,-1.27; 4 -6.35,1.27; 5 -3.81,-1.27; 6 -3.81,1.27; 7 -1.27,-1.27; 8 -1.27,1.27; 9 1.27,-1.27; 10 1.27,1.27; 11 3.81,-1.27; 12 3.81,1.27; 13 6.35,-1.27; 14 6.35,1.27; 15 8.89,-1.27; 16 8.89,1.27
1X03 = drill 1.016 octagon: 1 -2.54,0; 2 0,0; 3 2.54,0
1X15 = drill 1.016 octagon: 1 -17.78,0; 2 -15.24,0; 3 -12.7,0; 4 -10.16,0; 5 -7.62,0; 6 -5.08,0; 7 -2.54,0; 8 0,0; 9 2.54,0; 10 5.08,0; 11 7.62,0; 12 10.16,0; 13 12.7,0; 14 15.24,0; 15 17.78,0
1X16 = drill 1.016 long: 1 -19.05,0; 2 -16.51,0; 3 -13.97,0; 4 -11.43,0; 5 -8.89,0; 6 -6.35,0; 7 -3.81,0; 8 -1.27,0; 9 1.27,0; 10 3.81,0; 11 6.35,0; 12 8.89,0; 13 11.43,0; 14 13.97,0; 15 16.51,0; 16 19.05,0
1X04 = drill 1.016 long: 1 -3.81,0; 2 -1.27,0; 3 1.27,0; 4 3.81,0
SOT23 = smd 0.8 x 0.9: 1 -0.95,-1; 2 0.95,-1; 3 0,1
R0603 = smd 1 x 1.1: 1 -0.85,0; 2 0.85,0
MCP4728 = smd 1.2 x 0.3: P$1 -2.3,1; P$2 -2.3,0.5; P$3 -2.3,0; P$4 -2.3,-0.5; P$5 -2.3,-1; P$6 2.3,-1; P$7 2.3,-0.5; P$8 2.3,0; P$9 2.3,0.5; P$10 2.3,1
1X02 = drill 1.016 long: 1 -1.27,0; 2 1.27,0

### Placement (x,y rotation side)
1-1  30.84,17.99 0 top
1-1(+B)1  35.98,25.7 0 top
1-2  35.98,28.27 0 top
1-2(GND)1  35.98,17.99 0 top
1-3  25.7,17.99 0 top
1-3(5V)1  35.98,41.12 0 top
1-4(BOOST)1  35.98,33.41 0 top
1-9  25.7,20.56 0 top
1-21  20.56,17.99 0 top
1-22  20.56,33.41 0 top
1-23  15.42,17.99 0 top
1-24  15.42,33.41 0 top
1-25  30.84,25.7 0 top
1-26  30.84,41.12 0 top
1-27  25.7,25.7 0 top
1-28  25.7,41.12 0 top
1-29  20.56,25.7 0 top
1-30  20.56,41.12 0 top
1-31  15.42,25.7 0 top
1-32  15.42,41.12 0 top
2-1  64.25,20.56 0 top
2-5  59.11,20.56 0 top
2-6  59.11,28.27 0 top
2-9  53.97,20.56 0 top
2-10  53.97,28.27 0 top
2-17  43.69,20.56 0 top
2-18  43.69,28.27 0 top
2-19  64.25,17.99 0 top
2-20  64.25,33.41 0 top
2-21  59.11,17.99 0 top
2-22  59.11,33.41 0 top
2-23  53.97,17.99 0 top
2-24  53.97,33.41 0 top
2-25  48.83,17.99 0 top
2-26  48.83,33.41 0 top
2-27  43.69,17.99 0 top
2-28  64.25,25.7 0 top
2-29  64.25,41.12 0 top
2-30  59.11,25.7 0 top
2-31  59.11,41.12 0 top
2-32  53.97,25.7 0 top
2-33  53.97,41.12 0 top
2-34  48.83,25.7 0 top
2-35  48.83,41.12 0 top
2-36  43.69,25.7 0 top
3-1  87.38,20.56 0 top
3-6  82.24,28.27 0 top
3-9  77.1,20.56 0 top
3-10  77.1,28.27 0 top
3-11  77.1,35.98 0 top
3-12  77.1,43.69 0 top
3-13  71.96,20.56 0 top
3-14  71.96,28.27 0 top
3-15  71.96,35.98 0 top
3-16  71.96,43.69 0 top
3-17  87.38,17.99 0 top
3-18  87.38,33.41 0 top
3-19  82.24,17.99 0 top
3-20  82.24,33.41 0 top
3-21  77.1,17.99 0 top
3-22  77.1,33.41 0 top
3-23  71.96,17.99 0 top
3-24  71.96,33.41 0 top
3-25  87.38,25.7 0 top
3-26  87.38,41.12 0 top
3-27  82.24,25.7 0 top
3-28  82.24,41.12 0 top
3-29  77.1,25.7 0 top
3-30  77.1,41.12 0 top
3-31  71.96,25.7 0 top
3-32  71.96,41.12 0 top
5VA  35.98,35.98 0 top
5VB  35.98,43.69 0 top
11-2  30.84,33.41 0 top
11-4  25.7,33.41 0 top
A1  82.24,43.69 0 top
A2  82.24,35.98 0 top
AD_A1  59.11,43.69 0 top
AD_A2  59.11,35.98 0 top
AD_B1  64.25,43.69 0 top
AD_B2  64.25,35.98 0 top
AD_B3  64.25,28.27 0 top
B1  87.38,43.69 0 top
B2  87.38,35.98 0 top
B3  87.38,28.27 0 top
BST_E  25.7,43.69 0 top
BST_S  25.7,35.98 0 top
BUCK1_1  3.85,64.25 90 top
BUCK1_2  7.71,64.25 90 top
BUCK2_1  3.85,60.4 90 top
BUCK_2_2  7.71,60.4 90 top
CLK  15.42,43.69 0 top
CS_BK1  20.56,43.69 0 top
CS_BK2  20.56,35.98 0 top
CS_BST  20.56,28.27 0 top
D1  73.25,83.53 180 top
D2  73.25,80.95 180 top
D3  73.25,78.39 180 top
DEBG1  25.7,28.27 0 top
H/L  56.54,61.68 90 top
HL_BK  53.97,35.98 0 top
IG1  6.42,38.55 180 top
JP1  24.41,12.85 0 bottom
JP2  53.97,12.85 0 bottom
JP3  80.95,12.85 0 bottom
JP4  15.42,79.67 0 top
JP5  38.56,79.71 0 top
JP6  46.19,79.65 0 top
JP7  23.13,79.67 0 top
JP8  30.84,79.67 0 top
JP9  15.42,77.1 0 top
JP10  69.39,70.67 270 top
JP11  66.82,70.67 270 top
JP12  64.25,70.67 270 top
JP13  30.84,77.1 0 top
JP14  89.95,70.67 270 top
JP15  87.38,70.67 270 top
JP16  84.81,70.67 270 top
JP17  38.55,77.1 0 top
JP18  23.13,77.1 0 top
JP19  46.26,77.1 0 top
JP20  15.42,74.53 0 top
JP21  23.13,74.53 0 top
JP22  30.84,74.53 0 top
JP23  38.55,74.53 0 top
JP24  46.26,74.53 0 top
JP25  15.42,71.96 0 top
JP26  23.13,71.96 0 top
JP27  30.84,71.96 0 top
JP28  38.55,71.96 0 top
JP29  46.26,71.96 0 top
JP30  15.42,69.39 0 top
JP31  23.13,69.39 0 top
JP32  30.84,69.39 0 top
JP33  38.55,69.39 0 top
JP34  46.26,69.39 0 top
JP35  15.42,66.82 0 top
JP36  23.13,66.82 0 top
JP37  30.84,66.82 0 top
JP38  38.55,66.82 0 top
JP39  46.26,66.82 0 top
JP40  15.42,64.25 0 top
JP41  23.13,64.25 0 top
JP42  30.84,64.25 0 top
JP43  38.55,64.25 0 top
JP44  46.26,64.25 0 top
JP45  15.42,61.68 0 top
JP46  23.13,61.68 0 top
JP47  30.84,61.68 0 top
JP48  38.55,61.68 0 top
JP49  46.26,61.68 0 top
JP50  15.42,59.11 0 top
JP51  23.13,59.11 0 top
JP52  30.84,59.11 0 top
JP53  38.55,59.11 0 top
JP54  46.26,59.11 0 top
JP55  15.42,56.54 0 top
JP56  23.13,56.54 0 top
JP57  30.84,56.54 0 top
JP58  38.55,56.54 0 top
JP59  25.7,51.4 0 top
JP60  46.26,56.54 0 top
JP61  25.7,84.81 0 top
JP63  7.71,6.42 180 top
LED_5VA  3.85,80.95 90 top
LED_5VB  3.85,78.39 90 top
LED_BOOST  3.85,73.25 90 top
LED_IG1  3.85,75.81 90 top
LED温1  48.83,35.98 0 top
LED温2  48.83,28.27 0 top
LED温3  48.83,20.56 0 top
MISO  15.42,35.98 0 top
MOSI  15.42,28.27 0 top
Q1  3.85,33.41 0 bottom
Q2  3.85,19.27 0 bottom
Q3  7.71,33.41 0 bottom
Q4  7.71,19.27 0 bottom
Q5  53.97,84.09 270 top
Q6  56.54,52.69 0 top
Q7  59.11,86.09 0 top
R1  3.85,80.95 0 bottom
R2  3.85,78.39 0 bottom
R3  7.71,64.25 0 bottom
R4  3.85,64.25 0 bottom
R5  3.85,60.4 0 bottom
R6  7.71,60.4 0 bottom
R7  5.78,70.67 270 bottom
R8  2.57,70.67 270 bottom
R9  5.78,66.82 270 bottom
R10  2.57,66.82 270 bottom
R11  61,74 270 top
R12  3.85,75.81 0 bottom
R13  3.85,29.55 0 bottom
R14  3.85,15.42 0 bottom
R15  7.71,29.55 180 bottom
R16  7.71,15.42 180 bottom
R17  50.12,85.09 270 top
R18  56.54,48.83 0 top
R19  59.11,82.24 180 top
TURN  56.54,74.53 90 top
TURN_S  53.97,43.69 0 top
U$1  78.39,60.4 270 bottom
U_RX  20.56,20.56 0 top
U_TX  15.42,20.56 0 top
UDIM1-1  30.84,43.69 0 top
UDIM1-2  30.84,35.98 0 top
UDIM2-1  30.84,28.27 0 top
UDM2-2  30.84,20.56 0 top
VBST  35.98,20.56 0 top
VBU  6.42,24.41 180 top
内温  48.83,43.69 0 top
放電  82.24,20.56 0 top
電源  5.14,44.98 180 top

### Tracks (layer width: path | path; a pad name or v marks a point on that pad's centre or on a via)
5VA
  Top 0.152: JP61.12 34.5,85 32.5,85 JP61.11 32,85 30,85 JP61.10 29.5,85 27,85 JP61.9 26.5,85 24.5,85 JP61.8 24,85 22,85 JP61.7 21.5,85 19.5,85 JP61.6 19,85 17,85 JP61.5 16.5,85 14.5,85 JP61.4 14,85 12,85 JP61.3 11.5,85 9.5,85 JP61.2 9,85 7,85 JP61.1 | JP61.12 35,85 37,85 JP61.13 37.5,85 39.5,85 JP61.14 40,85 42,85 JP61.15 42.5,85 44.5,85 JP61.16 45.19,85.25 R17.2 51.22,83.14 Q5.2 53.33,82.79 53.33,73.89 55.23,71.99 TURN.1 59.84,71.99 R11.2 | JP1.3 33.42,11.58 34.7,12.85 34.7,32.12 1-4(BOOST)1.1 36.14,33.79 36.14,35.79 5VA.1 35.98,39.72 36.97,40.71 36.97,44.1 35.98,45.09 35.98,52.69 34.7,53.97 34.7,84.7 JP61.12
  Bottom 0.152: JP61.1 6.65,84.6 R1.2
5VB  (via drill 0.35)
  Top 0.152: JP1.4 33.4,14.12 34.39,15.12 34.39,39.53 1-3(5V)1.1 36.14,41.21 36.14,43.21 5VB.1 34.7,44.98 34.7,48.83 33.41,50.12 33.41,53.33 16.06,53.33 13.84,55.55 12.47,55.55 11.53,56.49 11.53,64.71 9.64,66.61 9.64,75.81 8.35,77.1 v6.42,77.1
  Bottom 0.152: v6.42,77.1 3.85,77.1 3,77.95 R2.2
+B
  Top 0.152: 1-2.1 36.14,28.21 36.14,25.71 1-1(+B)1.1 37.27,24.41 37.27,15.42 35.97,14.12 JP1.2
+B(電源)
  Top 0.508: 2.57,30.84 VBU.3
  Top 2.54: 電源.2 2.57,44.98 2.57,30.84 2.57,24.41
  Bottom 1.016: VBU.3 3.85,24.41 2.57,23.13 2.57,18.61 Q2.2 2.9,15.52 R14.2 | IG1.3 3.85,38.55 2.57,37.27 2.57,32.74 Q1.2 2.85,32.41 2.57,32.12 2.57,29.99 R13.2
  pour Top: 4.5,47.67 1.28,47.55 1.28,23.13 4.5,23.26
A1
  Top 0.152: JP3.8 82.22,14.15 80.95,15.42 80.95,39.84 3-28.1 82.64,41.21 82.64,43.21 A1.1 82.24,50.76 81.6,51.4 81.6,73.25 79.03,75.81 71.96,75.81 70.47,77.3 68.98,77.3 68.4,77.89 68.4,78.7 69.39,79.7 JP10.4
A2
  Top 0.152: JP3.7 82.25,11.58 83.53,12.85 83.53,32.12 3-20.1 82.14,33.79 82.14,35.79 A2.1 83.53,37.27 83.53,50.76 82.24,52.04 82.24,73.89 79.67,76.46 71.96,76.46 70.12,78.3 JP10.5
AD_A1
  Top 0.152: AD_A1.1 59.14,43.21 59.14,41.21 2-31.1 57.52,39.53 57.52,15.12 56.52,14.12 JP2.8
AD_A2
  Top 0.152: AD_A2.1 59.14,35.79 59.14,33.79 2-22.1 57.83,32.12 57.83,12.85 56.55,11.58 JP2.7
AD_B1
  Top 0.152: AD_B1.1 64.64,43.21 64.64,41.21 2-29.1 62.66,39.53 62.66,16.4 61.59,15.33 JP2.4
AD_B2
  Top 0.152: AD_B2.1 64.14,35.79 64.14,33.79 2-20.1 62.97,32.12 62.97,12.85 61.7,11.58 JP2.3
AD_B3
  Top 0.152: AD_B3.1 64.14,28.21 64.14,25.71 2-28.1 65.53,24.41 65.53,15.42 64.23,14.12 JP2.2
B1
  Top 0.152: B1.1 87.64,43.21 87.64,41.21 3-26.1 86.09,39.84 86.09,15.42 87.31,14.21 JP3.4
  Bottom 0.152: B1.1 86.09,44.98 86.09,59.11 84.81,60.4 JP16.12
B2  (via drill 0.35)
  Top 0.152: B2.1 87.64,35.79 87.64,33.79 3-18.1 88.67,32.12 88.67,12.85 87.39,11.58 JP3.3 | v86.09,42.41 86.09,56.54 84.81,57.83 JP16.13
  Bottom 0.152: B2.1 86.09,37.27 v86.09,42.41
B3
  Top 0.152: 3-25.1 B3.1
  Bottom 0.152: JP3.2 89.84,23.02 89.95,23.13 3-25.1 | B3.1 84.81,30.84 84.81,48.83 82.24,51.4 82.24,53.97 83.7,55.44 JP16.14
BCK1UDIM1  (via drill 0.35)
  Top 0.152: 30.93,41.15 31.14,41.21 31.14,43.21 UDIM1-1.1 30.84,45.62 30.2,46.26 8.99,46.26 7.07,48.19 2.57,48.19 1.93,49.47 v1.93,62.97 | 30.93,41.15 1-26.1 | JP1.8 28.25,14.12 29.25,15.12 29.25,39.47 30.93,41.15
  Bottom 0.152: v1.93,62.97 3,64.04 R4.2
BCK1UDIM2  (via drill 0.35)
  Top 0.152: JP1.7 28.29,11.58 29.55,12.85 29.55,32.12 11-2.1 30.64,33.79 30.64,35.79 UDIM1-2.1 32.12,37.27 32.12,46.26 30.84,47.55 8.99,47.55 7.71,48.83 7.71,55.9 9.64,57.83 9.64,61.04 v8.35,62.32
  Bottom 0.152: v8.35,62.32 8.27,62.41 7.48,62.41 6.86,63.03 R3.2
BCK2UDIM1  (via drill 0.35)
  Top 0.152: JP1.6 30.82,14.12 32.12,15.42 32.12,24.41 1-25.1 30.64,25.71 30.64,28.21 UDIM2-1.1 32.77,30.2 32.77,46.9 31.48,48.19 11.56,48.19 10.92,48.83 10.92,49.47 10.28,50.12 v10.28,56.54 | v49,51 47,51 v40,44
  Bottom 0.152: v10.28,56.54 9.3,57.52 7.58,57.52 6.64,58.47 3.85,58.47 3.77,58.55 3.62,58.55 3,59.17 R5.2 | UDIM2-1.1 31.27,28.27 34,31 37,31 38,32 38,42 v40,44 | v49,51 68,51 69,52 69,52.51 JP10.15
BCK2UDIM2  (via drill 0.35)
  Top 0.152: UDM2-2.1 30.64,20.29 30.64,18.29 1-1.1 | v32.89,23.26 33.41,23.77 33.41,47.55 32.12,48.83 14.13,48.83 12.85,50.12 12.85,53.33 10.92,55.26 10.92,57.18 v10.28,57.83 | v49,50.1 47.1,50.1 v40,43
  Bottom 0.152: JP1.5 30.86,11.58 32.12,12.85 32.12,16.7 1-1.1 | UDM2-2.1 32.25,21.97 v32.89,23.26 33,23.26 33.55,23.81 37.81,23.81 39,25 39,42 v40,43 | v10.28,57.83 7.71,57.83 6.86,58.67 R6.2 | v49,50.1 69,50 71,52 71,54 70.83,54 JP10.14
BSTENABLE
  Top 0.152: BST_E.1 25.64,43.21 25.64,41.21 25.67,41.16 | 25.67,41.16 1-28.1 | JP1.12 23.14,14.15 24.11,15.12 24.11,39.6 25.67,41.16
BSTSYNC
  Top 0.152: BST_S.1 25.64,35.79 25.64,33.79 11-4.1 24.41,32.12 24.41,12.85 JP1.11
DEBUG1
  Top 0.152: DEBG1.1 25.64,28.21 25.64,25.71 1-27.1 26.98,24.41 26.98,15.42 JP1.10
DISCHARGE
  Top 0.152: 3-19.1 放電.1
  Bottom 0.152: JP3.5 84.77,11.61 83.53,12.85 83.53,16.7 3-19.1 | 放電.1 80.95,21.84 80.95,61.68 82.33,63.05 JP16.11
ESP32_HL_BKUP  (via drill 0.35)
  Top 0.152: R18.1 55.59,48.93 Q6.1 56.91,53.01 57.03,53.01 58.47,54.44 v58.47,54.61 | v60.4,56.54 61.04,57.18 61.04,69.39 63.61,71.96 70.03,71.96 71.47,72 v79.97,72 | JP16.6 84.75,75.81 82.88,75.81 v82.24,75.17
  Bottom 0.152: v82.24,75.17 v79.97,72 | v60.4,56.54 v58.47,54.61
ESP32_SPI_CS
  Top 0.152: 69.43,83.41 JP10.3 68.02,82 63,82 62.63,81.63 62.63,81.47 61,79.84 R11.1 | D3.A 72.55,78.45 71,80 71,81.98 | 71,81.98 71,82 70.84,82 69.43,83.41 | D2.A 72.03,80.95 71,81.98 | D1.A 69.54,83.53 69.43,83.41
ESP32_TURN_SYNC
  Top 0.152: Q7.1 58.16,82.34 R19.2 59.55,80.95 61.68,80.95 62.32,81.6 62.32,83.53 63.61,84.81 81.6,84.81 82.88,83.53 82.88,81.6 83.64,80.83 JP16.4
ESP_IG1_SW  (via drill 0.35)
  Top 0.152: v66.18,48.83 68.11,50.76 68.11,64.25 69.39,65.53 JP10.10
  Bottom 0.152: R15.2 8.66,29.66 Q3.1 15.42,39.17 | 15.42,39.17 15.42,39.19 | 15.42,39.17 16.7,40.45 16.7,48.19 17.35,48.83 v66.18,48.83
ESP_VBU_SW  (via drill 0.35)
  Top 0.152: v66.82,47.55 70.67,51.4 70.67,61.68 69.39,62.97 JP10.11
  Bottom 0.152: R16.2 8.56,18.18 Q4.1 12.87,21.84 15.42,22.49 17.99,25.06 17.99,46.9 18.63,47.55 v66.82,47.55
GND  (via drill 0.35)
  Top 0.152: LED_5VA.C 3.1,79.67 | 3.1,79.67 LED_5VB.C LED_IG1.C LED_BOOST.C | BUCK1_1.C 3.1,61.68 | 3.1,61.68 BUCK2_1.C | 3.1,61.68 3.53,62.1 v5.84,62.1 | v5.84,62.1 6.96,63.22 BUCK1_2.C | v5.84,62.1 6.96,60.98 BUCK_2_2.C | 3.1,79.67 v6.42,79.67 | H/L.1 56.54,59.11 59.75,55.9 59.75,53.3 Q6.2 57.39,51.59 R18.2 | v61.04,81.6 60.6,82.03 R19.1 60.06,82.34 Q7.2 60.88,85.92 JP12.2 JP11.2 JP10.2 JP16.2 JP15.2 JP14.2
  Top 0.508: v12.85,34.7 v12.85,38.55 | v12.85,19.27 v12.85,24.41
  Bottom 0.152: Q3.2 6.76,29.66 R15.1 7.07,29.35 7.07,28.27 7.71,27.63 v12.85,27.63 | Q4.2 6.76,15.52 R16.1 6.86,14.98 11.56,10.28 11.56,6.47 JP63.1 | JP59.1 JP59.2 JP59.3 JP59.4 JP59.5 JP59.6 JP59.7 JP59.8 JP59.9 JP59.10 JP59.11 JP59.12 JP59.13 JP59.14 JP59.15 JP59.16
  Bottom 2.54: 電源.1 6.42,51.4 JP59.1 | JP63.1 14.13,8.99
  pour Bottom: 87.38,82.24 3.85,82.24 3.85,48.83 5.14,44.98 12.21,42.41 12.21,10.28 10.28,7.71 10.28,5.14 15.42,5.14 16.7,8.99 88.67,8.99 91.23,12.85 91.23,77.1
HL_BKUP
  Top 0.152: JP2.11 51.43,11.6 52.69,12.85 52.69,32.19 54.03,33.53 54.03,33.47 2-24.1 54.14,33.79 54.14,35.79 HL_BK.1 55.26,37.27 55.26,46.9 54.61,47.55 54.61,51.88 55.09,52.36 55.22,52.36 Q6.3 54.61,55.61 54.61,59.75 H/L.2
IG1
  Top 1.016: IG1.2 6.42,37.27 11.56,32.12 11.56,14.71 11.56,14.13 8.99,11.56 8.99,6.44 JP63.2
  Bottom 0.152: IG1.2 1.28,43.69 1.28,74.53 2.57,75.81 R12.2
  Bottom 1.016: IG1.2 5.37,37.49 5.37,37.11 3.85,35.59 Q1.3
INSIDE_THM
  Top 0.152: 内温.1 49.14,43.21 49.14,41.21 2-35.1 47.24,39.53 47.24,15.12 46.35,14.22 JP2.16
  Bottom 0.152: U$1.P$6 79.67,57.81 79.67,53.97 80.31,53.33 80.31,32.77 77.74,30.2 49.47,30.2 47.55,32.12 47.55,39.84 2-35.1
LED_THM1
  Top 0.152: LED温1.1 48.64,35.79 48.64,33.79 2-26.1 47.55,32.12 47.55,12.85 46.35,11.65 JP2.15
  Bottom 0.152: U$1.P$7 78.91,57.97 78.91,57.4 78.93,57.38 78.93,54.07 79.67,53.33 79.67,32.77 77.74,30.84 50.12,30.84 48.83,32.12 2-26.1
LED_THM2  (via drill 0.35)
  Top 0.152: JP2.14 48.89,14.2 50.12,15.42 50.12,24.41 2-34.1 48.64,25.71 48.64,28.21 LED温2.1 48.83,29.55 v50.76,31.48
  Bottom 0.152: U$1.P$8 78.39,53.97 79.03,53.33 79.03,32.77 77.74,31.48 v50.76,31.48
LED_THM3  (via drill 0.35)
  Top 0.152: 2-25.1 48.64,18.29 48.64,20.29 LED温3.1 | v51.4,32.12 v51.4,21.84
  Bottom 0.152: JP2.13 48.89,11.62 50.12,12.85 50.12,16.7 2-25.1 | U$1.P$9 77.86,57.97 77.86,57.4 77.84,57.28 77.84,53.97 78.39,53.33 78.39,32.77 77.74,32.12 v51.4,32.12 | v51.4,21.84 50.12,20.56 LED温3.1
LIN_TX  (via drill 0.35)  (1 unrouted)
  Top 0.152: v79.03,72.75 78.4,73.22 JP10.7 | 2-18.1 43.64,28.21 43.64,25.71 2-36.1 44.98,24.41 44.98,15.42 43.81,14.26 JP2.18
  Bottom 0.152: 78.91,62.82 78.91,63.39 79.03,64.21 v79.03,72.75
N$1  (via drill 0.35)
  Top 0.152: LED_5VB.A v6.42,78.39
  Bottom 0.152: R2.1 v6.42,78.39
N$2  (via drill 0.35)
  Top 0.152: LED_5VA.A v6.42,80.95
  Bottom 0.152: R1.1 v6.42,80.95
N$3  (via drill 0.35)
  Top 0.152: BUCK1_1.A 3.85,63.5 v3.85,62.97
  Bottom 0.152: R4.1 3.85,63.4 v3.85,62.97
N$4
  Bottom 0.152: R7.2 R9.1
N$6
  Bottom 0.152: R8.2 R10.1
N$7
  Top 0.152: 17.84,79.67 JP4.1 | 17.84,79.67 JP4.3 | JP4.2 17.84,79.67
N$8
  Top 0.152: JP5.1 JP5.3 JP5.2
N$9
  Top 0.152: JP6.1 JP6.3 JP6.2
N$10
  Top 0.152: 25.4,79.67 JP7.1 | 25.4,79.67 JP7.3 | JP7.2 25.4,79.67
N$11
  Top 0.152: JP8.1 JP8.3 JP8.2
N$12
  Top 0.152: 17.57,77.1 JP9.3 | 17.57,77.1 JP9.1 | JP9.2 17.57,77.1
N$13
  Top 0.152: JP13.1 JP13.3 JP13.2
N$14
  Top 0.152: JP17.1 JP17.3 JP17.2
N$15
  Top 0.152: 23.55,77.1 JP18.3 JP18.2 23.55,77.1 | 23.55,77.1 JP18.1
N$16
  Top 0.152: JP19.1 JP19.3 JP19.2
N$17
  Top 0.152: 1-9.1 25.64,20.29 25.64,18.29 1-3.1
  Bottom 0.152: JP1.9 25.71,11.58 26.98,12.85 26.98,16.7 1-3.1
N$18
  Top 0.152: 17.37,74.53 JP20.1 | 17.37,74.53 JP20.3 | JP20.2 17.37,74.53
N$19
  Top 0.152: 25.64,74.53 JP21.1 | 25.64,74.53 JP21.3 | JP21.2 25.64,74.53
N$20  (via drill 0.35)
  Top 0.152: BUCK1_2.A 7.71,63.5 v7.71,62.97
  Bottom 0.152: R3.1 7.71,63.4 v7.71,62.97
N$21
  Top 0.152: 2-1.1 64.14,20.29 64.14,18.29 2-19.1
  Bottom 0.152: JP2.1 64.27,11.58 65.53,12.85 65.53,16.7 2-19.1
N$22
  Top 0.152: JP22.1 JP22.3 JP22.2
N$23
  Top 0.152: 2-5.1 59.14,20.29 59.14,18.29 2-21.1
  Bottom 0.152: JP2.5 59.12,11.58 60.4,12.85 60.4,16.7 2-21.1
N$24
  Top 0.152: JP23.1 JP23.3 JP23.2
N$25
  Top 0.152: 2-9.1 54.14,20.29 54.14,18.29 2-23.1
  Bottom 0.152: JP2.9 53.98,11.58 55.26,12.85 55.26,16.7 2-23.1
N$26
  Top 0.152: JP24.1 JP24.3 JP24.2
N$27
  Top 0.152: JP25.1 JP25.3 JP25.2
N$28
  Top 0.152: JP26.1 JP26.3 JP26.2
N$29
  Top 0.152: 2-27.1 43.64,18.29 43.64,20.29 2-17.1
  Bottom 0.152: JP2.17 43.81,11.69 44.98,12.85 44.98,16.7 2-27.1
N$31
  Top 0.152: JP27.1 JP27.3 JP27.2
N$32
  Top 0.152: JP28.3 | JP28.3 JP28.1 | JP28.2 JP28.3
N$33
  Top 0.152: JP29.1 JP29.3 JP29.2
N$34
  Top 0.152: 2-10.1 54.14,28.21 54.14,25.71 2-32.1 | 2-32.1 | JP2.10 53.97,14.13 55.26,15.42 55.26,24.42 2-32.1
N$35
  Top 0.152: 17.57,69.39 JP30.1 | 17.57,69.39 JP30.3 | JP30.2 17.57,69.39
N$36
  Top 0.152: 59.14,28.21 2-6.1 2-30.1 | 2-30.1 59.14,25.71 | JP2.6 59.09,14.12 60.4,15.42 60.4,24.41 2-30.1
N$37
  Top 0.152: JP31.1 JP31.3 JP31.2
N$38
  Top 0.152: 33.25,69.39 JP32.1 | 33.25,69.39 JP32.3 | JP32.2 33.25,69.39
N$39
  Top 0.152: 3-17.1 3-1.1
  Bottom 0.152: JP3.1 89.84,11.67 88.67,12.85 88.67,16.7 3-17.1
N$40
  Top 0.152: JP33.1 JP33.3 JP33.2
N$41
  Top 0.152: JP34.1 JP34.3 JP34.2
N$42
  Top 0.152: 17.75,66.82 JP35.3 | 17.75,66.82 JP35.1 | JP35.2 17.75,66.82
N$43
  Top 0.152: 3-21.1 3-9.1
  Bottom 0.152: JP3.9 79.66,11.58 78.39,12.85 78.39,16.7 3-21.1
N$44
  Top 0.152: 3-11.1 77.14,35.79 77.14,33.79 3-22.1 78.39,32.12 78.39,12.85 77.14,11.61 JP3.11
N$45
  Top 0.152: 3-23.1 3-13.1
  Bottom 0.152: JP3.13 74.52,11.58 73.25,12.85 73.25,16.7 3-23.1
N$46
  Top 0.152: 3-24.1 72.14,33.79 72.14,35.79 3-15.1 | 3-24.1 | JP3.15 72.06,11.67 73.25,12.85 73.25,32.13 3-24.1
N$47
  Top 0.152: JP36.1 JP36.3 JP36.2
N$48
  Top 0.152: JP15.3 JP14.3
N$49
  Top 0.152: 3-27.1 3-6.1
  Bottom 0.152: JP3.6 84.77,23.09 84.81,23.13 3-27.1
N$50
  Top 0.152: JP37.1 JP37.3 JP37.2
N$51
  Top 0.152: 3-29.1 3-10.1
  Bottom 0.152: JP3.10 79.69,23.11 3-29.1
N$52
  Top 0.152: 3-12.1 77.14,43.21 77.14,41.21 3-30.1 75.81,39.84 75.81,15.42 77.11,14.12 JP3.12
N$53
  Top 0.152: 3-31.1 3-14.1
  Bottom 0.152: JP3.14 74.61,23.05 3-31.1
N$54
  Top 0.152: 71.99,41.13 72.14,41.21 72.14,43.21 3-16.1 | 71.99,41.13 3-32.1 | 72.06,14.24 JP3.16 71.97,14.12 70.67,15.42 70.67,39.84 70.69,39.84 71.99,41.13
N$55  (via drill 0.35)
  Top 0.152: BUCK2_1.A 3.85,59.65 v3.85,59.11
  Bottom 0.152: R5.1 3.85,59.55 v3.85,59.11
N$56  (via drill 0.35)
  Top 0.152: BUCK_2_2.A 7.71,59.65 v7.71,59.11
  Bottom 0.152: R6.1 7.71,59.55 v7.71,59.11
N$57
  Top 0.152: JP38.1 JP38.3 JP38.2
N$58  (via drill 0.35)
  Top 0.152: LED_BOOST.A v5.78,73.25
  Bottom 0.152: v5.78,73.25 R7.1 R8.1
N$59
  Top 0.152: Q7.3 58.06,87.05 Q5.1 51.87,84.94 R17.1
N$60  (via drill 0.35)
  Top 0.152: LED_IG1.A v6.42,75.81
  Bottom 0.152: R12.1 v6.42,75.81
N$61
  Top 0.152: JP15.4 JP14.4
N$62
  Bottom 0.152: R13.1 4.71,32.31 Q1.1 4.8,33.08 6.42,34.7 7.42,34.7 Q3.3
N$63
  Bottom 0.152: R14.1 4.71,18.18 Q2.1 5.59,18.27 6.26,18.95 6.39,18.95 Q4.3
N$64
  Top 0.152: JP15.5 JP14.5
N$65
  Top 0.152: JP15.6 JP14.6
N$66
  Top 0.152: JP15.7 JP14.7
N$67
  Top 0.152: JP15.8 JP14.8
N$68
  Top 0.152: JP15.9 JP14.9
N$70
  Top 0.152: JP15.10 JP14.10
N$71
  Top 0.152: JP15.11 JP14.11
N$72
  Top 0.152: JP15.12 JP14.12
N$73
  Top 0.152: JP15.13 JP14.13
N$74
  Top 0.152: JP15.14 JP14.14
N$75
  Top 0.152: JP15.15 JP14.15
N$76
  Top 0.152: JP12.1 JP11.1
N$77
  Top 0.152: JP39.1 JP39.3 JP39.2
N$78
  Top 0.152: JP12.3 JP11.3
N$79
  Top 0.152: JP12.4 JP11.4
N$80
  Top 0.152: JP12.5 JP11.5
N$81
  Top 0.152: JP12.6 JP11.6
N$82
  Top 0.152: JP12.8 JP11.8
N$83
  Top 0.152: JP12.7 JP11.7
N$84
  Top 0.152: JP12.9 JP11.9
N$85
  Top 0.152: JP12.10 JP11.10
N$86
  Top 0.152: JP12.11 JP11.11
N$87
  Top 0.152: JP12.12 JP11.12
N$88
  Top 0.152: JP12.13 JP11.13
N$89
  Top 0.152: JP12.14 JP11.14
N$90
  Top 0.152: JP12.15 JP11.15
N$91  (via drill 0.35)
  Top 0.152: v77.74,70.03 77.1,70.67 JP10.8
  Bottom 0.152: U$1.P$2 77.86,63.32 77.76,64.29 77.74,64.31 v77.74,70.03
N$92  (via drill 0.35)
  Top 0.152: JP10.9 77.71,68.14 v78.39,67.46
  Bottom 0.152: U$1.P$3 v78.39,67.46
N$93
  Top 0.152: JP40.1 JP40.3 JP40.2
N$94
  Top 0.152: JP41.1 JP41.3 JP41.2
N$95
  Top 0.152: JP42.1 JP42.3 JP42.2
N$96
  Top 0.152: JP43.1 JP43.3 JP43.2
N$97
  Top 0.152: JP44.1 JP44.3 JP44.2
N$98
  Top 0.152: JP45.1 JP45.3 JP45.2
N$99
  Top 0.152: 25.57,61.68 JP46.3 | 25.57,61.68 JP46.1 | JP46.2 25.57,61.68
N$100
  Top 0.152: JP47.1 JP47.3 JP47.2
N$101
  Top 0.152: JP48.1 JP48.3 JP48.2
N$102
  Top 0.152: JP49.1 JP49.3 JP49.2
N$103
  Top 0.152: JP50.1 JP50.3 JP50.2
N$104
  Top 0.152: 25.31,59.11 JP51.1 | 25.31,59.11 JP51.3 | JP51.2 25.31,59.11
N$105
  Top 0.152: 33.24,59.11 JP52.1 | 33.24,59.11 JP52.3 | JP52.2 33.24,59.11
N$106
  Top 0.152: JP53.1 JP53.3 JP53.2
N$107
  Top 0.152: JP54.1 JP54.3 JP54.2
N$108
  Top 0.152: JP55.1 JP55.3 JP55.2
N$109
  Top 0.152: JP56.1 JP56.2 JP56.3
N$110
  Top 0.152: JP57.1 JP57.3 JP57.2
N$111
  Top 0.152: 38.75,56.54 JP58.3 | 38.75,56.54 JP58.2 | JP58.1 38.75,56.54
N$112
  Top 0.152: JP60.1 JP60.3 JP60.2
SPI_CLK
  Top 0.152: CLK.1 15.64,43.21 15.64,41.21 15.43,41.12 | 15.43,41.12 1-32.1 | JP1.20 12.98,14.27 13.83,15.12 13.83,39.52 15.43,41.12
  Bottom 0.152: CLK.1 15.42,48.19 16.7,49.47 74.53,49.47 75.81,50.76 75.81,73.25 80.95,78.39 81.05,78.3 JP16.5
SPI_CS_BK1  (via drill 0.35)
  Top 0.152: CS_BK1.1 20.64,43.21 20.64,41.21 1-30.1 18.97,39.53 18.97,15.12 18.07,14.21 JP1.16 | v71.96,46.9 v71.96,63.61 | v75.17,83.53 D1.C
  Bottom 0.152: CS_BK1.1 20.56,45.62 21.2,46.26 71.32,46.26 v71.96,46.9 | v71.96,63.61 71.96,73.25 75.81,77.1 75.81,82.88 v75.17,83.53
SPI_CS_BK2  (via drill 0.35)
  Top 0.152: CS_BK2.1 20.64,35.79 20.64,33.79 20.56,33.43 | 20.56,33.43 1-22.1 | JP1.15 18.07,11.64 19.27,12.85 19.27,32.14 20.56,33.43 | v73.25,46.9 v73.25,63.61 | v76.46,80.95 D2.C
  Bottom 0.152: CS_BK2.1 21.84,37.27 21.84,44.98 22.49,45.62 71.96,45.62 v73.25,46.9 | v73.25,63.61 73.25,73.25 77.1,77.1 77.1,80.31 v76.46,80.95
SPI_CS_BST  (via drill 0.35)
  Top 0.152: 20.64,25.71 20.64,28.21 CS_BST.1 | 20.64,25.71 1-29.1 | JP1.14 20.61,14.18 21.84,15.42 21.84,24.5 20.64,25.71 | v74.53,46.9 v74.53,63.61 | v77.74,78.39 D3.C
  Bottom 0.152: CS_BST.1 22.49,30.2 22.49,44.33 23.13,44.98 72.6,44.98 v74.53,46.9 | v74.53,63.61 74.53,73.25 78.39,77.1 78.39,77.74 v77.74,78.39
SPI_MISO
  Top 0.152: MISO.1 15.64,35.79 15.64,33.79 1-24.1 | 1-24.1 | JP1.19 12.98,11.7 14.13,12.85 14.13,32.13 1-24.1
SPI_MOSI
  Top 0.152: 15.64,25.71 15.64,28.21 MOSI.1 | 15.64,25.71 1-31.1 | JP1.18 15.53,14.24 16.7,15.42 16.7,24.64 15.64,25.71
  Bottom 0.152: MOSI.1 17.35,30.2 17.35,47.55 17.99,48.19 75.81,48.19 76.46,48.83 76.46,73.25 80.31,77.1 85.45,77.1 86.09,77.74 86.09,82.88 85.6,83.38 JP16.3
TURN_SYNC  (via drill 0.35)
  Top 0.152: JP2.12 51.43,14.16 52,14.73 52,39.15 2-33.1 54.14,41.21 54.14,43.21 TURN_S.1 53.97,57.18 53.33,57.83 v53.33,71.96 | Q5.3 55.26,83.81 55.26,80.31 53.97,79.03 53.97,76.46 55.9,74.53 TURN.2
  Bottom 0.152: v53.33,71.96 55.9,74.53 TURN.2
UARTRX
  Top 0.152: 1-21.1 20.64,18.29 20.64,20.29 U_RX.1
  Bottom 0.152: JP1.13 20.61,11.61 21.84,12.85 21.84,16.7 1-21.1
UARTTX  (via drill 0.35)
  Top 0.152: 1-23.1 15.64,18.29 15.64,20.29 U_TX.1 | v70.67,47.55 71.32,48.19 71.32,62.97 v70.67,63.61
  Bottom 0.152: JP1.17 15.53,11.67 16.7,12.85 16.7,16.7 1-23.1 | U_TX.1 18.63,23.77 18.63,46.26 19.27,46.9 70.03,46.9 v70.67,47.55 | v70.67,63.61 70.67,74.53 69.45,75.75 JP10.6
USB_5V
  Top 0.152: JP15.1 JP14.1
  Bottom 0.152: U$1.P$1 77.39,63.62 77,64 77,73 80,76 83.16,76 84.4,74.76 90.76,74.76 92,76 92,87 91,88 90.41,88 JP14.1
VBST  (via drill 0.35)
  Top 0.152: VBST.1 36,20.29 36,18.29 1-2(GND)1.1 | v33.78,23.26 34.09,23.56 34.09,39.66 34.05,39.69 34.05,48.19 32.59,49.65 16.4,49.65 15.82,50.23 15.82,50.36 15.42,50.76 15.42,53.33 14.78,53.97 13.49,53.97 11.23,56.23 11.23,57.95 10.92,58.26 10.92,64.89 v8.99,66.82
  Bottom 0.152: JP1.1 35.99,11.58 37.27,12.85 37.27,16.7 1-2(GND)1.1 | R10.2 R9.2 5.99,65.97 7.07,66.82 v8.99,66.82 | VBST.1 34.57,21.97 v33.78,23.26
VBU
  Top 1.016: VBU.2 6.42,6.44 JP63.3
  Bottom 1.016: VBU.2 5.37,23.36 5.37,22.98 3.85,21.46 Q2.3

### Text on the board
tNames: 5V | GND | +B | GND | 20 | 2 | 18 | 2 | 16 | 2 | 1 | 17 | 1 | 15 | 1 | 19